# Altium project vfd_power_v2.PrjPcb
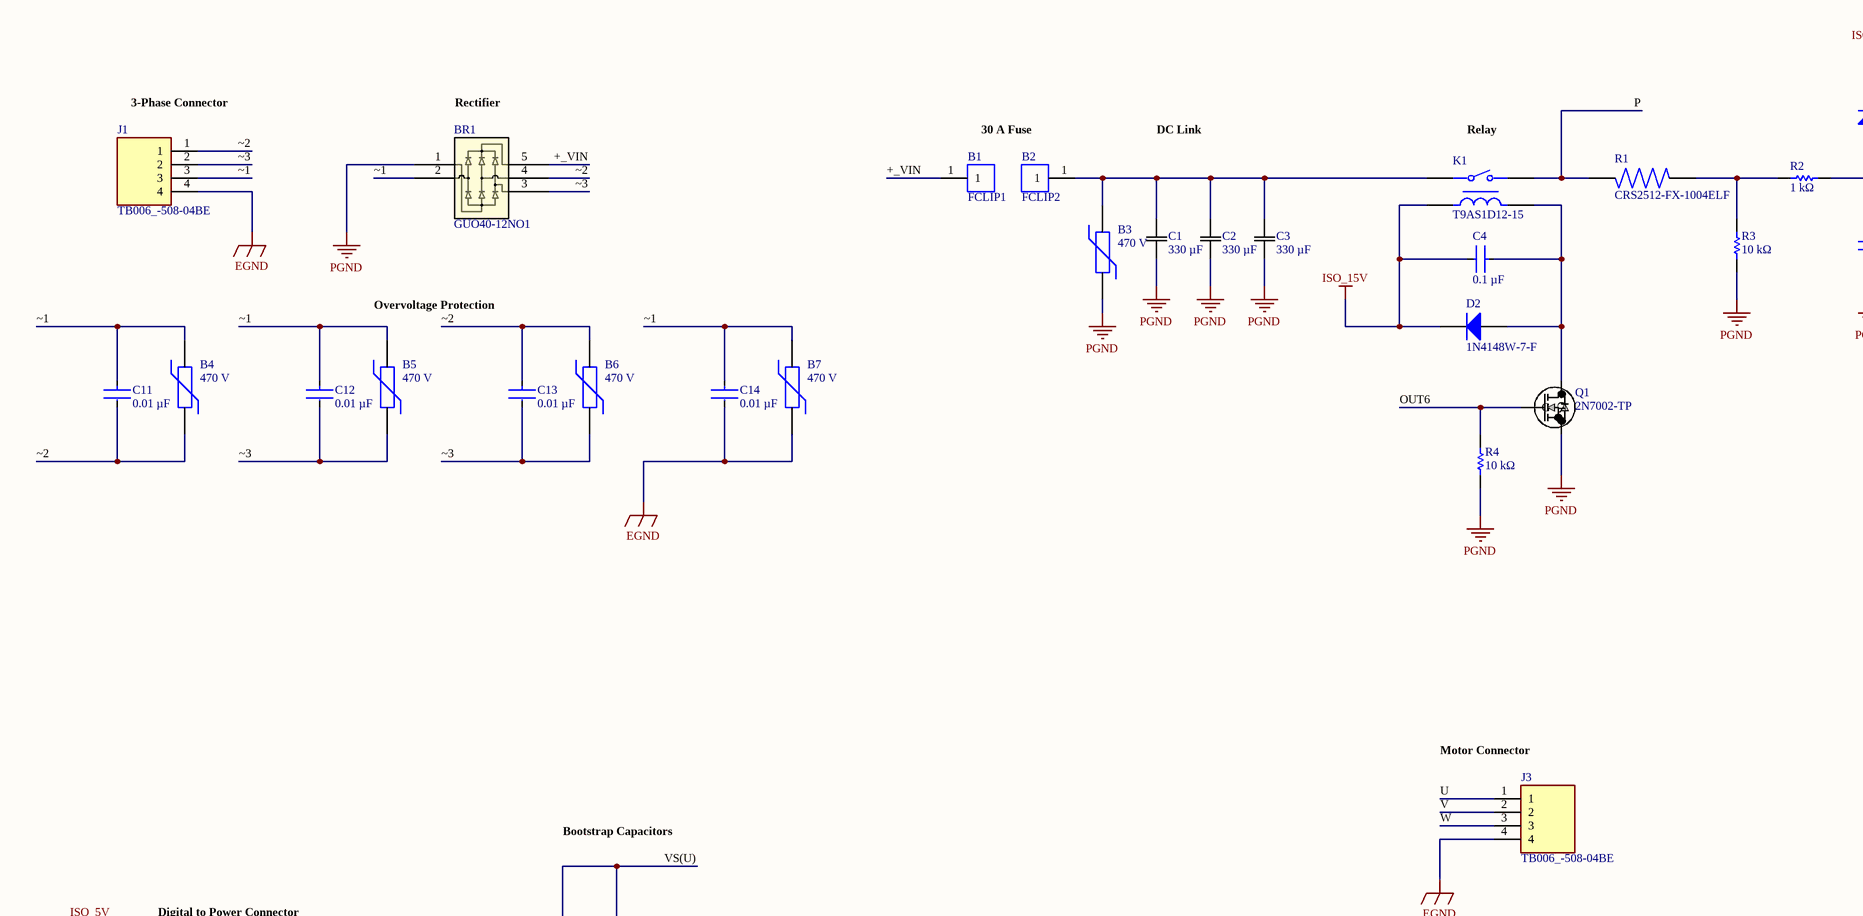
[diagram p0: vfd_power_v2.SchDoc, top left]
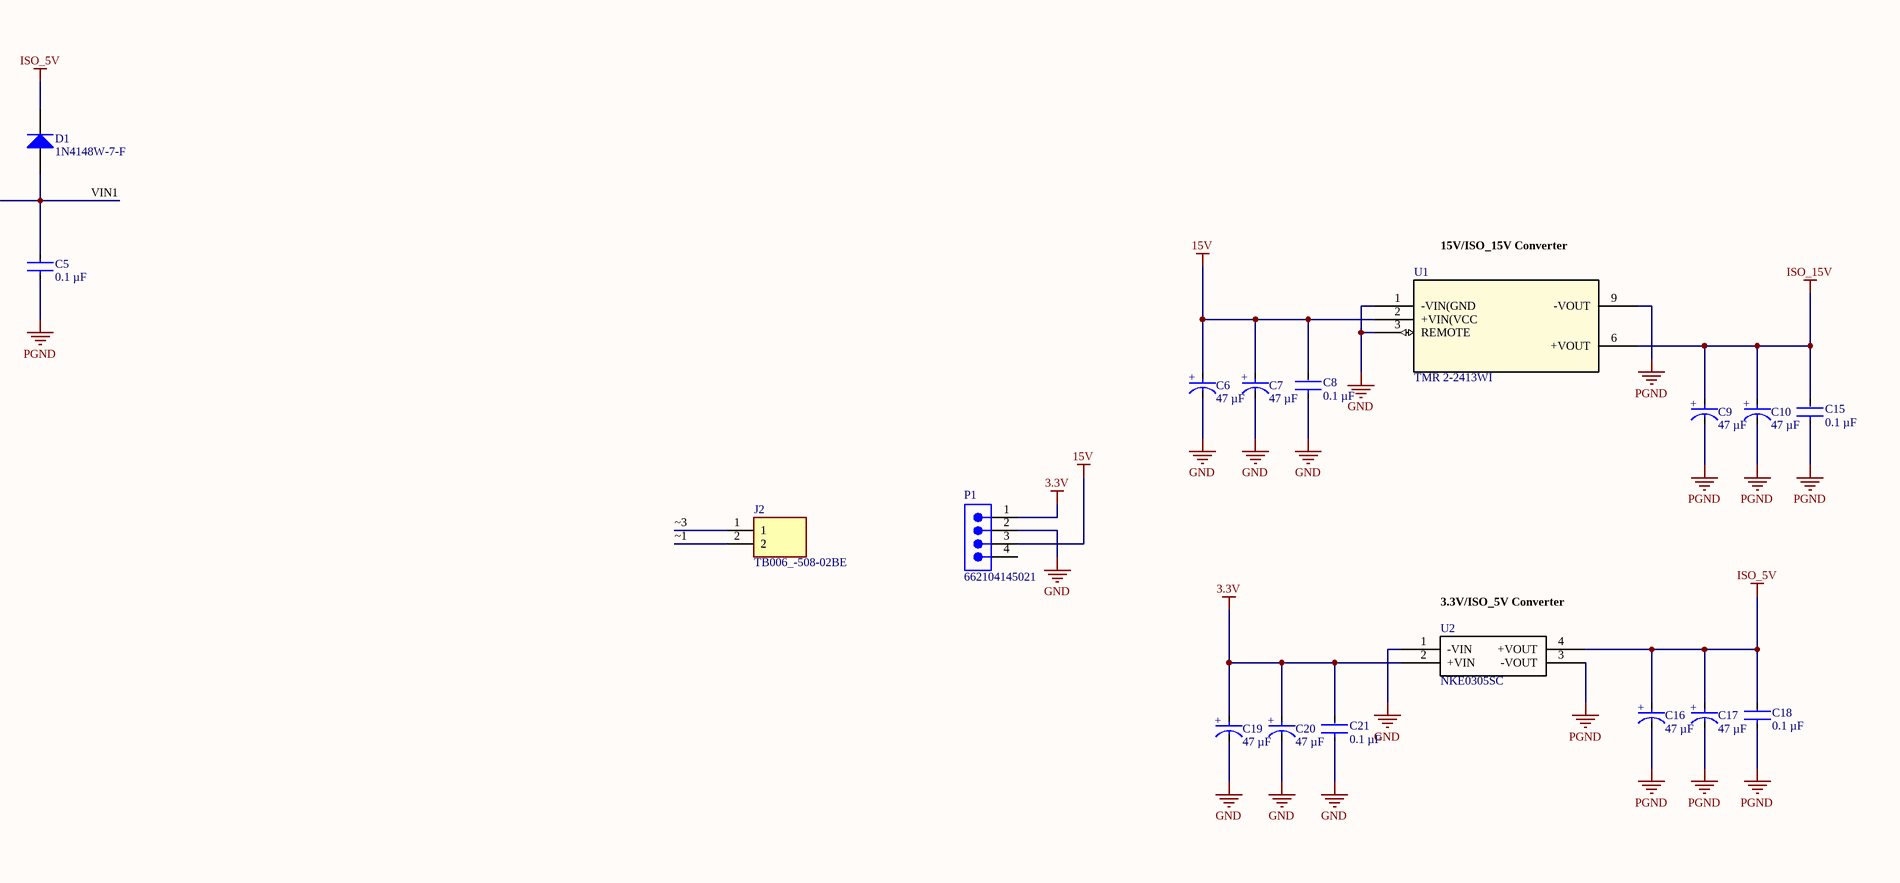
[diagram p1: vfd_power_v2.SchDoc, top right]
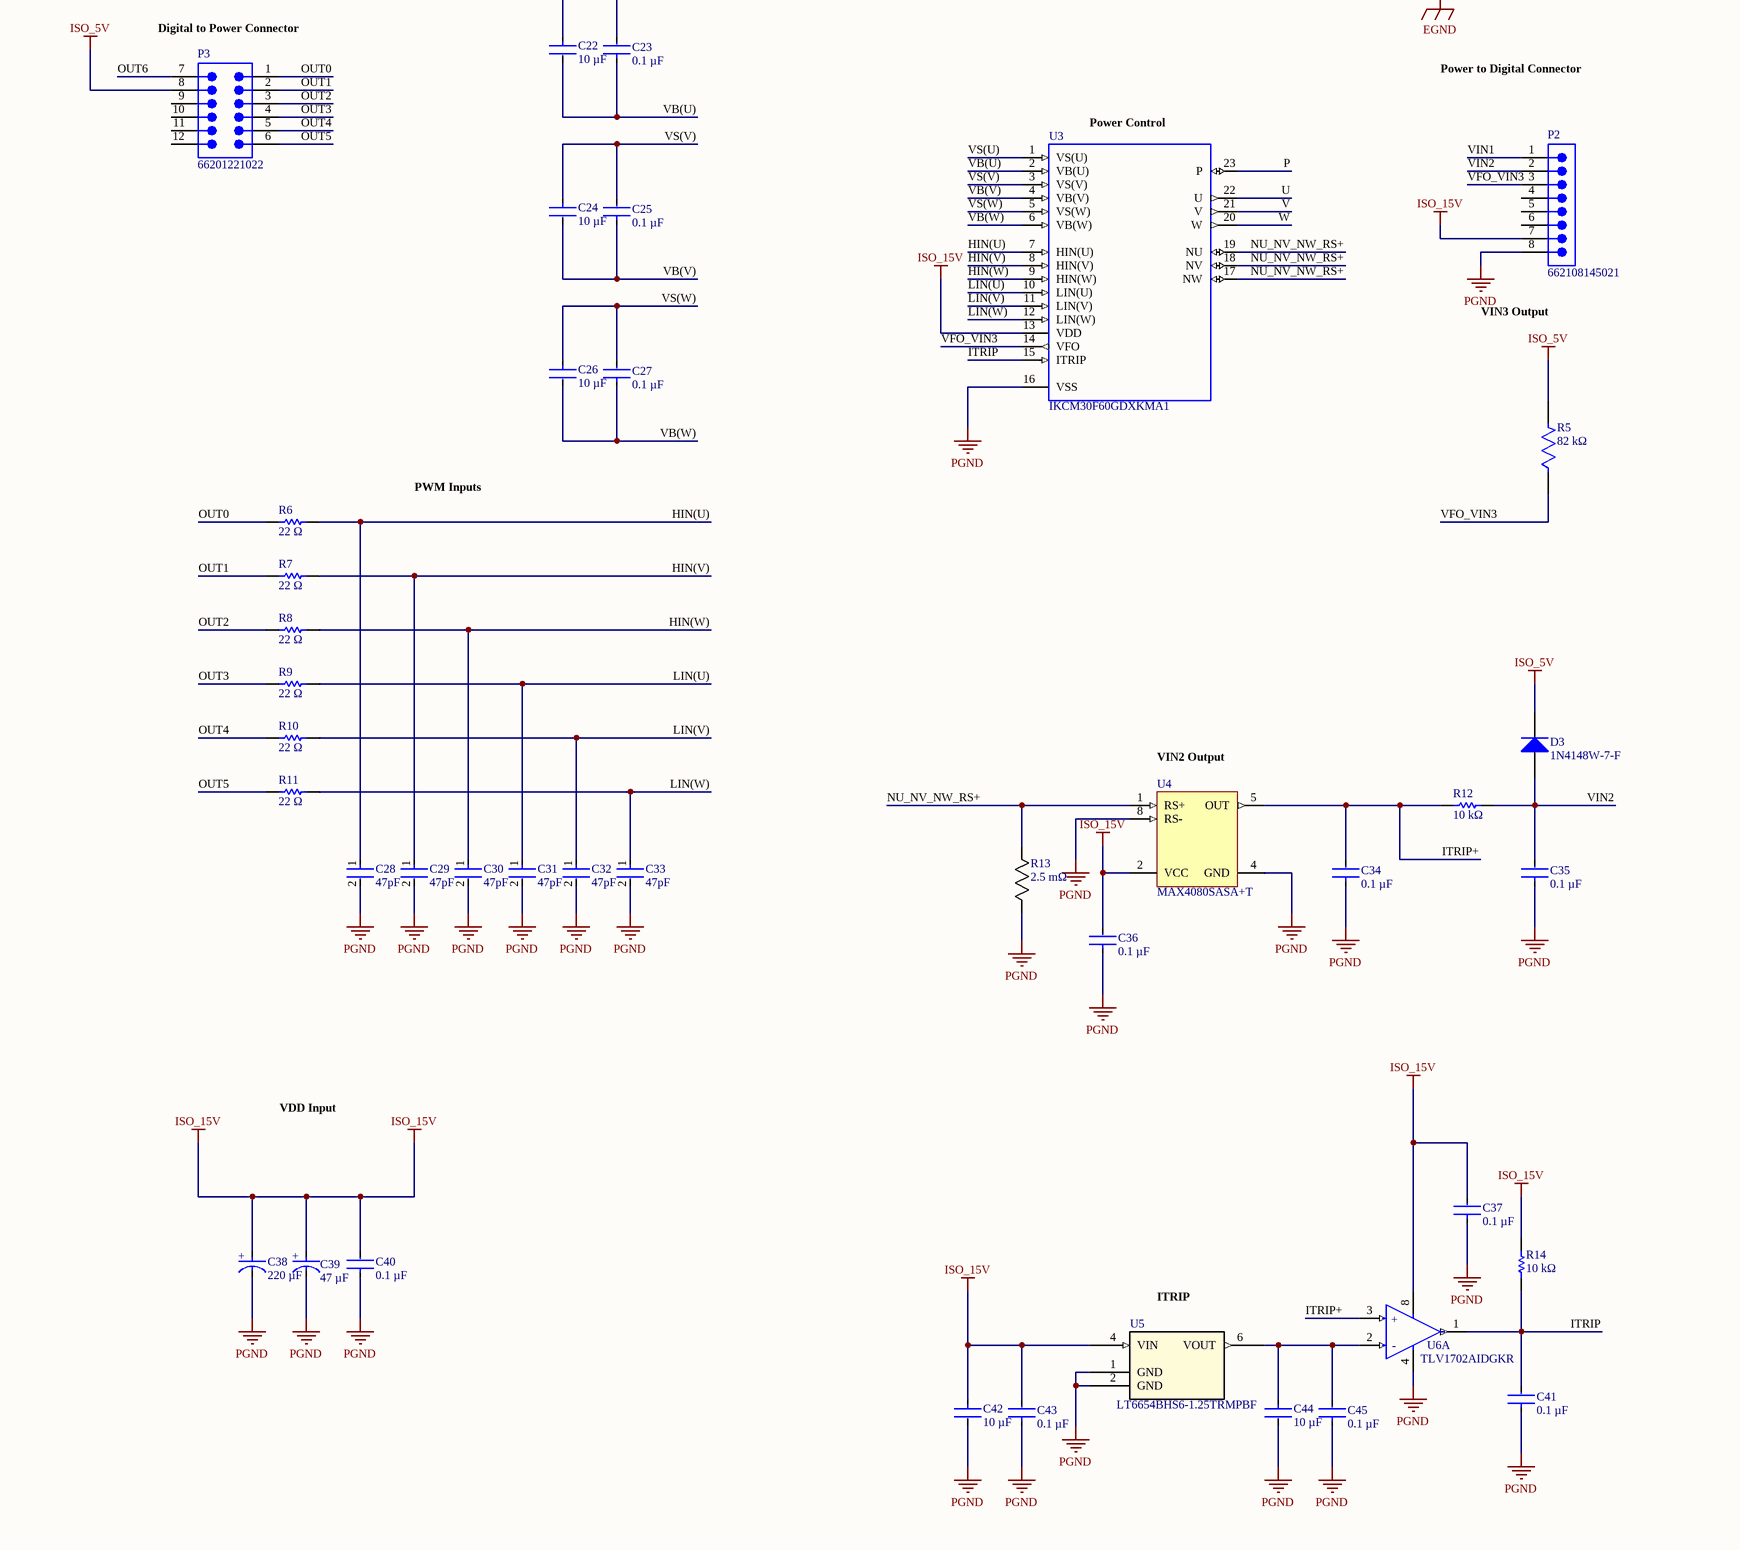
[diagram p2: vfd_power_v2.SchDoc, bottom left]
1 sheet, 84 parts. Net scope: global (net labels, ports and power ports of the same name join across sheets).
Board file: vfd_power_v2.PcbDoc

## Sheet vfd_power_v2.SchDoc
size D; SheetNumber: 1; SheetTotal: 1

### Parts
B1  FCLIP1  [01240061H]
B2  FCLIP2  [01240061H]
B3  470 V  [TMOV14RP300E]
B4  470 V  [TMOV14RP300E]
B5  470 V  [TMOV14RP300E]
B6  470 V  [TMOV14RP300E]
B7  470 V  [TMOV14RP300E]
BR1  GUO40-12NO1  [SIP5-GUFP_LTF]
C1  330 µF  [CAP_C30_NCH]
C2  330 µF  [CAP_C30_NCH]
C3  330 µF  [CAP_C30_NCH]
C4  0.1 µF  [FP-CL31-IPC_C]
C5  0.1 µF  [FP-CL31-IPC_C]
C6  47 µF  [FP-T521X476M035ATE030-MFG]
C7  47 µF  [FP-T521X476M035ATE030-MFG]
C8  0.1 µF  [FP-CL31-IPC_C]
C9  47 µF  [FP-T521X476M035ATE030-MFG]
C10  47 µF  [FP-T521X476M035ATE030-MFG]
C11  0.01 µF  [FP-GRM55D-0_4-IPC_B]
C12  0.01 µF  [FP-GRM55D-0_4-IPC_B]
C13  0.01 µF  [FP-GRM55D-0_4-IPC_B]
C14  0.01 µF  [FP-GRM55D-0_4-IPC_B]
C15  0.1 µF  [FP-CL31-IPC_C]
C16  47 µF  [FP-T521X476M035ATE030-MFG]
C17  47 µF  [FP-T521X476M035ATE030-MFG]
C18  0.1 µF  [FP-CL31-IPC_C]
C19  47 µF  [FP-T521X476M035ATE030-MFG]
C20  47 µF  [FP-T521X476M035ATE030-MFG]
C21  0.1 µF  [FP-CL31-IPC_C]
C22  10 µF  [FP-CGA5L-0_3-0_1-IPC_B]
C23  0.1 µF  [FP-CL31-IPC_C]
C24  10 µF  [FP-CGA5L-0_3-0_1-IPC_B]
C25  0.1 µF  [FP-CL31-IPC_C]
C26  10 µF  [FP-CGA5L-0_3-0_1-IPC_B]
C27  0.1 µF  [FP-CL31-IPC_C]
C28  47pF  [FP-CL21-IPC_C]
C29  47pF  [FP-CL21-IPC_C]
C30  47pF  [FP-CL21-IPC_C]
C31  47pF  [FP-CL21-IPC_C]
C32  47pF  [FP-CL21-IPC_C]
C33  47pF  [FP-CL21-IPC_C]
C34  0.1 µF  [FP-CL31-IPC_C]
C35  0.1 µF  [FP-CL31-IPC_C]
C36  0.1 µF  [FP-CL31-IPC_C]
C37  0.1 µF  [FP-CL31-IPC_C]
C38  220 µF  [FP-RAD-TH-D_10_0_5-L_16_1-MFG]
C39  47 µF  [FP-T521X476M035ATE030-MFG]
C40  0.1 µF  [FP-CL31-IPC_C]
C41  0.1 µF  [FP-CL31-IPC_C]
C42  10 µF  [FP-CGA5L-0_3-0_1-IPC_B]
C43  0.1 µF  [FP-CL31-IPC_C]
C44  10 µF  [FP-CGA5L-0_3-0_1-IPC_B]
C45  0.1 µF  [FP-CL31-IPC_C]
D1  1N4148W-7-F  [DIOD-SOD123-2_V]
D2  1N4148W-7-F  [DIOD-SOD123-2_V]
D3  1N4148W-7-F  [DIOD-SOD123-2_V]
J1  TB006_-508-04BE  [CUI_TB006 -508-04BE]
J2  TB006_-508-02BE  [CUI_TB006 -508-02BE]
J3  TB006_-508-04BE  [CUI_TB006 -508-04BE]
K1  T9AS1D12-15  [FP-T9AS1D12-15-MFG]
P1  662104145021  [662104145021]
P2  662108145021  [662108145021]
P3  66201221022  [66201221022]
Q1  2N7002-TP  [SOT-23_MCC]
R1  CRS2512-FX-1004ELF  [RESC6432X75N]
R2  1 kΩ  [RESC2013X60X30ML20T20]
R3  10 kΩ  [RESC3225X60X45NL20T20]
R4  10 kΩ  [RESC1005X40X25ML05T05]
R5  82 kΩ  [FP-RC0603-0_55-IPC_C]
R6  22 Ω  [RESC2013X60X30ML20T20]
R7  22 Ω  [RESC2013X60X30ML20T20]
R8  22 Ω  [RESC2013X60X30ML20T20]
R9  22 Ω  [RESC2013X60X30ML20T20]
R10  22 Ω  [RESC2013X60X30ML20T20]
R11  22 Ω  [RESC2013X60X30ML20T20]
R12  10 kΩ  [RESC1005X40X25ML05T05]
R13  2.5 mΩ  [RES_WSLP3921_.002OHM_VIS]
R14  10 kΩ  [RESC1005X40X25ML05T05]
U1  TMR 2-2413WI  [TMR2WI-SINGLE_TRP]
U2  NKE0305SC  [SIP_NKE_11P5X6_MUR]
U3  IKCM30F60GDXKMA1  [IC_IKCM30F60GDXKMA1]
U4  MAX4080SASA+T  [MAXM-S8+2_M]
U5  LT6654BHS6-1.25TRMPBF  [TSOT-23_S6_LIT]
U6  TLV1702AIDGKR  [FP-DGK0008A-IPC_C]  (part A of 2)

### Nets
3.3V: C19.2(A) C20.2(A) C21.2 P1.1 U2.2(+VIN)
15V: C6.2(A) C7.2(A) C8.2 P1.3 U1.2(+VIN(VCC)
EGND: B7.1 C14.2 J1.4 J3.4
GND: C6.1(C) C7.1(C) C8.1 C19.1(C) C20.1(C) C21.1 P1.2 U1.1(-VIN(GND) U1.3(REMOTE) U2.1(-VIN)
ISO_5V: C16.2(A) C17.2(A) C18.2 D1.2(K) D3.2(K) P3.8 R5.2 U2.4(+VOUT)
ISO_15V: C4.2 C9.2(A) C10.2(A) C15.2 C36.2 C37.2 C38.2(A) C39.2(A) C40.2 C42.1 C43.2 D2.2(K) K1.3 P2.7 R14.2 U1.6(+VOUT) U3.13(VDD) U4.2(VCC) U5.4(VIN) U6.8(V+)
PGND: B3.1 BR1.1 C1.1 C2.1 C3.1 C5.1 C9.1(C) C10.1(C) C15.1 C16.1(C) C17.1(C) C18.1 C28.2 C29.2 C30.2 C31.2 C32.2 C33.2 C34.1 C35.1 C36.1 C37.1 C38.1(C) C39.1(C) C40.1 C41.1 C42.2 C43.1 C44.2 C45.1 P2.8 Q1.2(S) R3.1 R4.1 R13.1 U1.9(-VOUT) U2.3(-VOUT) U3.16(VSS) U4.4(GND) U4.8(RS-) U5.1(GND) U5.2(GND) U6.4(V-)
+_VIN: B1.1 BR1.5
HIN(U): C28.1 R6.2 U3.7(HIN(U))
HIN(V): C29.1 R7.2 U3.8(HIN(V))
HIN(W): C30.1 R8.2 U3.9(HIN(W))
ITRIP: C41.2 R14.1 U3.15(ITRIP) U6.1(1OUT)
ITRIP+: C34.2 R12.1 U4.5(OUT) U6.3(1IN+)
LIN(U): C31.1 R9.2 U3.10(LIN(U))
LIN(V): C32.1 R10.2 U3.11(LIN(V))
LIN(W): C33.1 R11.2 U3.12(LIN(W))
NU_NV_NW_RS+: R13.2 U3.17(NW) U3.18(NV) U3.19(NU) U4.1(RS+)
OUT0: P3.1 R6.1
OUT1: P3.2 R7.1
OUT2: P3.3 R8.1
OUT3: P3.4 R9.1
OUT4: P3.5 R10.1
OUT5: P3.6 R11.1
OUT6: P3.7 Q1.1(G) R4.2
P: K1.1 R1.2 U3.23(P)
U: J3.1 U3.22(U)
V: J3.2 U3.21(V)
VB(U): C22.2 C23.1 U3.2(VB(U))
VB(V): C24.2 C25.1 U3.4(VB(V))
VB(W): C26.2 C27.1 U3.6(VB(W))
VFO_VIN3: P2.3 R5.1 U3.14(VFO)
VIN1: C5.2 D1.1(A) P2.1 R2.2
VIN2: C35.2 D3.1(A) P2.2 R12.2
VS(U): C22.1 C23.2 U3.1(VS(U))
VS(V): C24.1 C25.2 U3.3(VS(V))
VS(W): C26.1 C27.2 U3.5(VS(W))
W: J3.3 U3.20(W)
~1: B4.2 B5.2 B7.2 BR1.2 C11.1 C12.1 C14.1 J1.3 J2.2
~2: B4.1 B6.2 BR1.4 C11.2 C13.1 J1.1
~3: B5.1 B6.1 BR1.3 C12.2 C13.2 J1.2 J2.1
NetB2_1: B2.1 B3.2 C1.2 C2.2 C3.2 K1.2
NetC4_1: C4.1 D2.1(A) K1.4 Q1.3(D)
NetC44_1: C44.1 C45.2 U5.6(VOUT) U6.2(1IN-)
NetR1_1: R1.1 R2.1 R3.2

Not connected (* = marked no-connect by the designer): P1 4; P2 4 5 6; P3 9 10 11 12; U1 7(NC) 8(NC); U4 3(NC) 6(NC) 7(NC); U5 3(DNC) 5(DNC)

### Notes on the sheet
- (near J1) 3-Phase Connector
- Rectifier
- 30 A Fuse
- DC Link
- (near K1) Relay
- 15V/ISO_15V Converter
- Overvoltage Protection
- (near U2) 3.3V/ISO_5V Converter
- (near J3) Motor Connector
- Bootstrap Capacitors
- (near P3) Digital to Power Connector
- Power to Digital Connector
- (near U3) Power Control
- VIN3 Output
- PWM Inputs
- (near U4) VIN2 Output
- VDD Input
- (near U5) ITRIP
- (in symbol CMP-03016-000019-1) +
- (in symbol CMP-04896-000101-1, part A) +
- (in symbol CMP-05427-000403-1) +

### Library data of the parts
B1 B2 = 01240061H: Fuse Clip 40 A - 1 Circuit Cartridge Through Hole; Manufacturer_Name: LITTELFUSE; Geometry.Height: 10.67mm; Mouser Part Number: 576-01240061H; Mouser Price/Stock: https://www.mouser.co.uk/ProductDetail/Littelfuse/01240061H?qs=81r%252BiQLm7BSgqEC6g%252BUS9Q%3D%3D; Manufacturer_Part_Number: 01240061H; Datasheet Link: https://www.littelfuse.com/media?resourcetype=datasheets&itemid=281b065a-d81e-4e26-9035-84e73d4bb028&filename=littelfuse-fuse-clip-124-datasheet.pdf
B3-B7 = TMOV14RP300E: Var MOV 300VAC/385VDC 6000A 517V Thru-Hole Radial Bulk; Manufacturer_Name: LITTELFUSE; Geometry.Height: 22mm; Mouser Part Number: 576-TMOV14RP300E; Mouser Price/Stock: https://www.mouser.co.uk/ProductDetail/Littelfuse/TMOV14RP300E?qs=nXjUL3qLHyUFvQrdNOF75Q%3D%3D; Manufacturer_Part_Number: TMOV14RP300E; Datasheet Link: https://www.littelfuse.com/~/media/electronics/datasheets/varistors/littelfuse_varistor_tmov_itmov_datasheet.pdf.pdf
BR1 = GUO40-12NO1: No Description Available; Mfr_Name: Littelfuse Inc; RefDes: RefDes; Type: Type
C1-C3 = LGW2G331MELC30: 400V; Mfr_Name: Nichicon
C4 C5 C8 C15 C18 C21 C23 C25 C27 C34-C37 C40 C41 C43 C45 = CMP-13271-001731-1: Cap Ceramic 100nF 50V X7R ±10% SMD 1206 +125°C Embossed T/R; Voltage: 50V; Thickness: 0.037inch; Lead Free: Lead Free; Length: 3.2mm; Min Operating Temperature: -55°C; Package Quantity: 15000; Packaging: Tape and Reel; Mount: Surface Mount; Depth: 1.6mm; Case/Package: 1206; Voltage Rating (DC): 50V; Tolerance: 10%; Height: 0.85mm; Capacitance: 100nF; Radiation Hardening: No; Dielectric: X7R; Voltage Rating: 50V; Max Operating Temperature: 125°C; Width: 0.063inch
C6 C7 C9 C10 C16 C17 C19 C20 C39 = CMP-03016-000019-1: CAP TANT POLY 47UF 35V 2917 / 35V; Tolerance: 20%; Dissipation Factor: 10%; Life (Hours): 2000Hour; Polarity: Polar; ESR (Equivalent Series Resistance): 30mR; Mount: Surface Mount; Voltage Rating (DC): 35V; Height - Seated (Max): 0.169inch; Package Quantity: 1; Height: 4mm; Max Operating Temperature: 125°C; Width: 4.3mm; Packaging: Tape and Reel; Case/Package: 2917; Series: KO-CAP T521; Min Operating Temperature: -55°C; Depth: 4.3mm; Case Code (Metric): 7343; Number of Pins: 2; RoHS Compliant: Yes; Case Code (Imperial): 2917; Capacitance: 47uF; REACH SVHC: No SVHC; Features: General Purpose; Termination: SMD/SMT; Length: 7.3mm; Voltage Rating: 35V; Construction: Flat
C11-C14 = CMP-06035-012355-1: Chip Multilayer Ceramic Capacitors for General Purpose, 2220, 10000pF, U2J, -750ppm/°C, 5%, 1kV; Capacitance: 10nF; Dielectric: U2J; Packaging: Tape and Reel; Min Operating Temperature: -55°C; Thickness: 0.087inch; Max Operating Temperature: 125°C; Width: 0.197inch; Case Code (Metric): 5750; Length: 0.224inch; Package Quantity: 1000; Termination: SMD/SMT; Voltage Rating: 1kV; Tolerance: 5%; Height: 2mm; Case Code (Imperial): 2220; Case/Package: 2220; Voltage Rating (DC): 1kV; Mount: Surface Mount
C22 C24 C26 C42 C44 = CMP-08246-000748-1: Cap Ceramic 10uF 25V X7R 10% Pad SMD 1206 +125°C Automotive T/R; Package Quantity: 2000; Capacitance: 10uF; Termination: SMD/SMT; Mount: Surface Mount; Thickness: 0.071inch; Min Operating Temperature: -55°C; Length: 3.2mm; Dielectric: X7R; Case/Package: 1206; Weight: 0.000571oz; Ratings: AEC-Q200; Case Code (Metric): 3216; Tolerance: 10%; Case Code (Imperial): 1206; Composition: Ceramic; Depth: 1.6mm; Width: 1.6mm; Max Operating Temperature: 125°C; Voltage Rating (DC): 25V; Height: 1.6mm; Voltage Rating: 25V; Packaging: Tape and Reel
C28-C33 = CMP-13271-002187-1: CL21 Series 0805 47pF 50V ±5% Tolerance C0G Multilayer Ceramic Chip Capacitor; Temperature Coefficient: 300ppm/°C; Voltage Rating (DC): 50V; Max Operating Temperature: 125°C; Thickness: 0.03inch; Material: Ceramic; Tolerance: 5%; Min Operating Temperature: -55°C; Voltage Rating: 50V; Packaging: Tape and Reel; Depth: 1.25mm; Radiation Hardening: No; Width: 0.049inch; Mount: Surface Mount; Height: 0.65mm; Voltage: 50V; Length: 2mm; Package Quantity: 10000; Case/Package: 0805; Capacitance: 47pF; Dielectric: C0G
C38 = CMP-05427-000403-1: Aluminum Electrolytic Capacitors (Radial Lead Type) 220uF ±20% 50V; ESR (Equivalent Series Resistance): 30mR; Ripple Current: 1.65A; Lead Diameter: 0.6mm; Life (Hours): 8000Hour; Height: 16mm; Min Operating Temperature: -40°C; Lead Pitch: 5mm; Diameter: 10mm; Features: General Purpose; Tolerance: 20%; Mount: Through Hole; Number of Pins: 2; Series: FR; Max Operating Temperature: 105°C; Contact Plating: Tin; Impedance: 30mR; Length: 16mm; Package Quantity: 1; RoHS Compliant: Yes; Lead Free: Lead Free; Voltage Rating: 50V; Packaging: Ammo Pack; Radiation Hardening: No; Termination: Radial; Voltage Rating (DC): 50V; Case/Package: Radial; Capacitance: 220uF; REACH SVHC: No SVHC; Height - Seated (Max): 0.689inch
D1-D3 = CMP-2000-04932-2: Fast Switching Diode, 100 V, 0.15 A, -65 to 150 degC, 2-Pin?SOD123, RoHS, Tape and Reel; Recovery Time: 4ns; Brand: DiodesIncorporated; Unit Weight: 0.000353oz; Max Surge Current: 2A; Peak Reverse Voltage: 100V; Ir - Reverse Current: 1uA; Vf - Forward Voltage: 1.25V; Configuration: Single; If - Forward Current: 0.15A; Product Category: Diodes-GeneralPurpose,Power,Switching; Operating Temperature Range: -65Cto+150C; Packaging: Reel; Manufacturer URL: http://www.diodes.com/; Maximum Operating Temperature: +150C; Height: 1.25mm; Minimum Operating Temperature: -65C; Product: SwitchingDiodes; Package URL: http://www.diodes.com/datasheets/ds18004.pdf; Type: SwitchingDiode; Package Reference: SOD123-2; Width: 1.7mm; Datasheet URL: http://www.farnell.com/datasheets/1915529.pdf; Datasheet Version: Rev. 24-2, 10/2013; Series: 1N4148; Factory Pack Quantity: 3000; Length: 2.85mm; RoHS: True; Manufacturer: DiodesIncorporated; Mounting Style: SMD/SMT; Package / Case: SOD-123
J1 J3 = TB006_-508-04BE: 2~24 Poles, Screw Type, Horizontal, 5.08 Pitch, 26~14 (AWG), Terminal Block Connector; MP: TB006 -508-04BE; MF: CUI Devices; SnapEDA_Link: https://www.snapeda.com/parts/TB006%20-508-04BE/CUI+Devices/view-part/?ref=snap; Availability: In Stock; CUI_purchase_URL: https://www.cuidevices.com/product/interconnect/connectors/terminal-blocks/tb006-508-series?utm_source=snapeda.com&utm_medium=referral&utm_campaign=snapedaBOM; Check_prices: https://www.snapeda.com/parts/TB006%20-508-04BE/CUI+Devices/view-part/?ref=eda; Value: *; Purchase-URL: https://pricing.snapeda.com/search/part/TB006 -508-04BE/?ref=eda; Package: None; Price: None
J2 = TB006_-508-02BE: 2~24 Poles, Screw Type, Horizontal, 5.08 Pitch, 26~14 (AWG), Terminal Block Connector; MF: CUI Devices; MP: TB006 -508-02BE; CUI_purchase_URL: https://www.cuidevices.com/product/interconnect/connectors/terminal-blocks/tb006-508-series?utm_source=snapeda.com&utm_medium=referral&utm_campaign=snapedaBOM; Value: *; Check_prices: https://www.snapeda.com/parts/TB006%20-508-02BE/CUI+Devices/view-part/?ref=eda; SnapEDA_Link: https://www.snapeda.com/parts/TB006%20-508-02BE/CUI+Devices/view-part/?ref=snap; Availability: In Stock; Package: None; Purchase-URL: https://pricing.snapeda.com/search/part/TB006 -508-02BE/?ref=eda; Price: None
K1 = CMP-03395-000224-1: RELAY GEN PURPOSE SPST 30A 15V; Power Consumption: 1W; Coil Resistance: 225R; Release Time: 15ms; Max Voltage Rating (AC): 277V; Coil Current: 67mA; Coil Type: Non-Latching; Relay Type: General Purpose; Contact Current Rating: 30A; Coil Voltage (DC): 15V; Throw Configuration: SPST; Min Operating Temperature: -55°C; Termination: PCB; Depth: 27.43mm; Radiation Hardening: No; Contact Material: Silver; Package Quantity: 50; Series: T9A; Length: 32.5mm; Packaging: Bulk; Mount: Through Hole; Height: 20.4mm; Number of Pins: 4; RoHS Compliant: Yes; Max Operating Temperature: 85°C; Weight: 0.918oz; Operate Time: 15ms; ELV: Non-Compliant; Lead Free: Lead Free; Width: 27.4mm; Coil Power: 1W; Contact Voltage Rating (AC): 277V
P1 = CMP-1502-00484-2: NexarPartId: 23024783; Number of Contacts: 4; Connector Type: Male Pin, Socket; Insulation Resistance: 1GΩ; Contact Resistance: 10mΩ; Gender: Male; Operating Supply Voltage: 250V; Pitch: 3mm; Current Rating: 5A; Height: 14mm; Termination: Solder; RoHS: Compliant; Max Operating Temperature: 105°C; Width: 6.85mm; Number of Positions: 4; Lead Pitch: 3mm; Mount: Surface Mount; REACH SVHC: Unknown; Packaging: Tape and Reel; Contact Plating: Tin; Contact Material: Copper; Length: 15.65mm; Color: Black; Number of Pins: 4; Number of Rows: 1; Min Operating Temperature: -40°C; Fastening Type: Ramp
P2 = CMP-1502-00488-2: NexarPartId: 23024787; Insulation Resistance: 1GΩ; Current Rating: 5A; Number of Contacts: 8; Gender: Male; Operating Supply Voltage: 250V; Pitch: 3mm; Connector Type: Male Pin, Socket; Contact Resistance: 10mΩ; Contact Plating: Tin; RoHS: Compliant; Color: Black; Lead Pitch: 3mm; REACH SVHC: Unknown; Mount: Surface Mount; Max Operating Temperature: 105°C; Min Operating Temperature: -40°C; Length: 27.65mm; Fastening Type: Ramp; Height: 14mm; Number of Pins: 8; Number of Rows: 1; Width: 12.85mm; Packaging: Tape and Reel; Number of Positions: 8; Contact Material: Copper; Termination: Solder
P3 = CMP-1502-00369-2: NexarPartId: 23024718; Row Spacing: 2.9972mm; Pitch: 3mm; Number of Positions: 12; Connector Type: Male Pin, Socket; Contact Resistance: 10mΩ; Current Rating: 5A; Insulation Resistance: 1GΩ; Gender: Male; Operating Supply Voltage: 250V; Number of Pins: 12; Contact Plating: Tin; Max Operating Temperature: 105°C; Fastening Type: Latch; Min Operating Temperature: -40°C; RoHS: Compliant; Number of Rows: 2; Number of Contacts: 12; Mount: Through Hole; Lead Pitch: 3mm; Width: 21.7mm; Color: Black; Length: 21.7mm; Height: 8.9mm; Contact Material: Copper; Termination: Solder; REACH SVHC: Unknown
Q1 = 2N7002-TP: No Description Available; Mfr_Name: MCC; Type: Transistors
R2 = CMP-2001-04656-1: ±5%; Part Number: RK73B2ATTD102J; Manufacturer: KOA Speer
R3 = CMP-2005-01993-1: ±1%, 0.5W; Part Number: CRCW121010K0FKEA; Manufacturer: Vishay Dale
R4 R12 R14 = CMP-2002-01181-1: ±5%; Manufacturer: Panasonic; Part Number: ERT-J0EM103J
R5 = CMP-03412-048229-1: RES 82K OHM 5% 1/10W 0603; Power Rating: 100mW; Temperature Coefficient: 100ppm/°C; Voltage Rating (DC): 50V; Voltage Rating: 75V; Resistance: 82kR; Series: RC; Resistance Tolerance: 5%; Termination: SMD/SMT; Features: Moisture Resistant; Size Code: 0603; Min Operating Temperature: -55°C; Resistor Type: Thick Film; Width: 0.8mm; Military Standard: Not; Number of Pins: 2; Height: 0.022inch; Case/Package: 0603; Max Operating Temperature: 155°C; Case Code (Imperial): 0603; Depth: 0.8mm; REACH SVHC: No SVHC; Case Code (Metric): 1608; Weight: 7.1E-05oz; Packaging: Tape and Reel; Lead Free: Lead Free; Max Power Dissipation: 100mW; RoHS Compliant: Yes; Construction: Rectangular; Number of Terminations: 2; Package Quantity: 1; Tolerance: 5%; Length: 0.063inch
R6-R11 = CMP-2001-04578-1: Manufacturer: KOA Speer; Part Number: RK73B2ATTD220J
R13 = WSLP39212L500FEA: ±1%, 5W; Mfr_Name: Vishay
U1 = CMP-01539-55835505-1: TMR 2-2413WI Module DC-DC 24VIN 1-OUT 15V 135A 2W 7-Pin SIP; Isolation: Isolated; Number of Outputs: 1; Isolation Voltage: 1.5kV; Nominal Input Voltage: 24V; Radiation Hardening: No; Output Voltage: 15V; Depth: 9.3mm; NexarPartId: 55835505; Output Power: 2W; Max Operating Temperature: 85°C; Output Current: 135A; Number of Pins: 7; Mount: Through Hole; Case/Package: SIP; Length: 26mm; RoHS: Compliant; Min Operating Temperature: -40°C
U2 = NKE0305SC: No Description Available; Mfr_Name: Murata; RefDes: RefDes; Type: Type
U3 = IKCM30F60GDXKMA1: Fully isolated Dual In-Line molded module; MF: Infineon Technologies; Package: PowerDIP-24 Infineon; Price: None; Check_prices: https://www.snapeda.com/parts/IKCM30F60GDXKMA1/Infineon+Technologies/view-part/?ref=eda; Value: *; SnapEDA_Link: https://www.snapeda.com/parts/IKCM30F60GDXKMA1/Infineon+Technologies/view-part/?ref=snap; MP: IKCM30F60GDXKMA1; Availability: In Stock; Purchase-URL: https://pricing.snapeda.com/search?q=IKCM30F60GDXKMA1&ref=eda
U4 = CMP-0252-00176-1: 76 V, High-Side, Uni-directional Current-Sense Amplifier, 60 V / V Gain, -40 to 125 degC, 8-Pin SOIC (S8+2), Pb-Free, Tape and Reel; Bi-Dir. Curr. Sense: No; Gain: 5 V/V, 20 V/V ,60 V/V; Industry Qualified: Automotive - AECQ100, Automotive - General; Code_JEDEC: MS012; ComponentLink1URL: http://www.maximintegrated.com/; PackageVersion: Rev. D, 10/2012; ComponentLink2URL: http://datasheets.maximintegrated.com/en/ds/MAX4080-MAX4081.pdf; ComponentLink2Description: Datasheet; PartNumber: MAX4080SASA+T; ComponentLink3URL: http://pdfserv.maximintegrated.com/package_dwgs/21-0041.PDF; PackageReference: S8+2; DatasheetVersion: Rev. 4; ComponentLink1Description: Manufacturer URL; Mounting Technology: Surface Mount; ComponentLink3Description: Package Specification; PackageDescription: 8-Pin Small-Outline IC, Narrow (0.15in) (S8+2), Body 4.90 x 3.90 mm, Pitch 1.27 mm
U5 = LT6654BHS6-1.25TRMPBF: No Description Available; Mfr_Name: Analog Devices Inc; RefDes: RefDes; Type: Type
U6 = CMP-04896-000101-1: IC COMPARATOR DUAL 8VSSOP; Min Dual Supply Voltage: 1.1V; Max Supply Voltage: 36V; Input Bias Current: 15nA; Max Dual Supply Voltage: 18V; Propagation Delay: 560ns; Response Time: 780ns; Nominal Supply Current: 55uA; Input Offset Voltage (Vos): 3.5mV; Quiescent Current: 75uA; Min Supply Voltage: 2.2V; Power Supply Rejection Ratio (PSRR): -96.48dB; Output Current: 20mA; Number of Elements: 2; Mount: Surface Mount; RoHS Compliant: Yes; Lead Free: Lead Free; Max Operating Temperature: 125°C; REACH SVHC: No SVHC; Case/Package: VSSOP; Number of Pins: 8; Contact Plating: Gold; Max Input Current: 15nA; Series: -; Min Operating Temperature: -40°C; Type: General Purpose; Number of Channels: 2; Package Quantity: 2500; Packaging: Tape and Reel
R1 = CRS2512-FX-1004ELF: Package: None; Price: None; Value: *; MP: CRS2512-FX-1004ELF; Availability: Unavailable